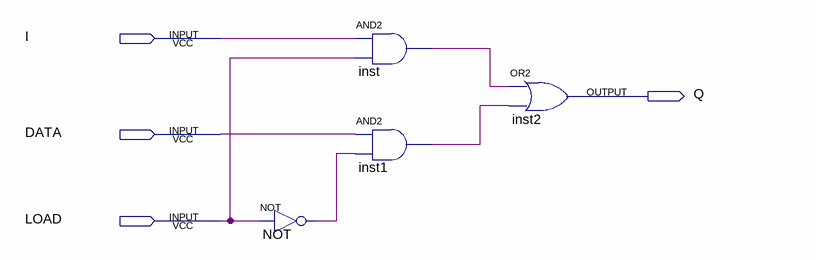
[diagram p0: schematic sheet]
// Quartus schematic MUX.bdf as structural Verilog: 4 symbols, 4 pins
module MUX (
  input  I,
  input  DATA,
  input  LOAD,
  output Q
);

  wire inst1_out, inst_out, NOT_out;

  not NOT (NOT_out, LOAD);
  and inst (inst_out, I, LOAD);
  and inst1 (inst1_out, DATA, NOT_out);
  or inst2 (Q, inst_out, inst1_out);
endmodule
